# Altium schematic sheet Interface.SchDoc
size A2
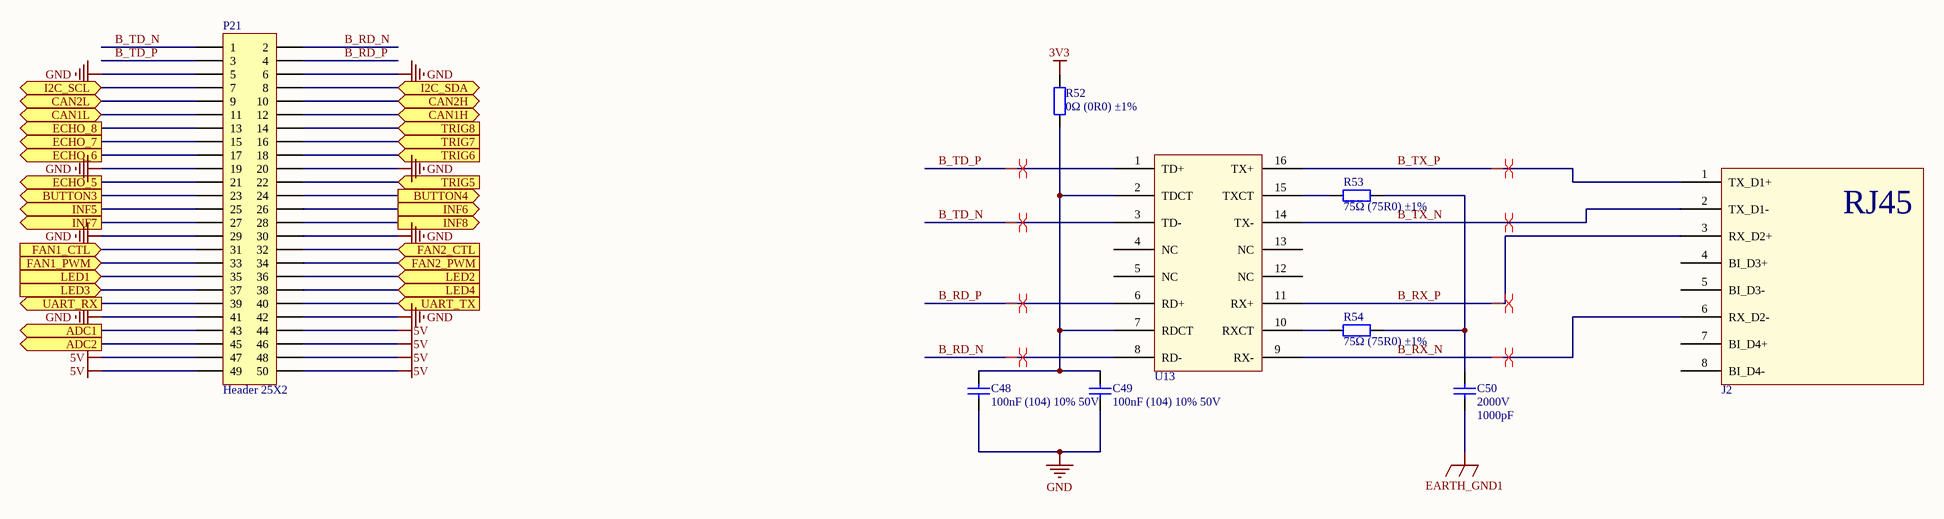
[diagram p0: Interface.SchDoc]

## Parts
C48  100nF (104) 10% 50V  [0603_C]
C49  100nF (104) 10% 50V  [0603_C]
C50  2000V  value 1000pF  [CAP1210N]
J2  Jack Modular Connector 8p8c (RJ45, Ethernet) Vertical Unshielded Cat3  [RJ45-5556416-1]  (value not drawn)
P21  Header 25X2  [HDR_2X25]
R52  0Ω (0R0) ±1%  [0603_R]
R53  75Ω (75R0) ±1%  [0603_R]
R54  75Ω (75R0) ±1%  [0603_R]
U13  TRANSFORMER  [Bel_transformer]  (value not drawn)

## Ports
ADC1 (out), ADC2 (out), BUTTON3 (out), BUTTON4 (out), CAN1H (bidir), CAN1L (bidir), CAN2H (bidir), CAN2L (bidir), ECHO_5 (out), ECHO_6 (out), ECHO_7 (out), ECHO_8 (out), FAN1_CTL (in), FAN1_PWM (in), FAN2_CTL (in), FAN2_PWM (in), I2C_SCL (bidir), I2C_SDA (bidir), INF5 (out), INF6 (out), INF7 (out), INF8 (out), LED1 (in), LED2 (in), LED3 (in), LED4 (in), TRIG5 (in), TRIG6 (in), TRIG7 (in), TRIG8 (in), UART_RX (out), UART_TX (in)

## Nets
3V3: R52.2
5V: P21.44 P21.46 P21.47 P21.48 P21.49 P21.50
EARTH_GND1: C50.1
GND: C48.2 C49.1 P21.5 P21.6 P21.19 P21.20 P21.29 P21.30 P21.41 P21.42
ADC1: P21.43 ; port ADC1
ADC2: P21.45 ; port ADC2
B_RD_N: P21.2 U13.8(RD-)
B_RD_P: P21.4 U13.6(RD+)
B_RX_N: J2.6(RX_D2-) U13.9(RX-)
B_RX_P: J2.3(RX_D2+) U13.11(RX+)
B_TD_N: P21.1 U13.3(TD-)
B_TD_P: P21.3 U13.1(TD+)
B_TX_N: J2.2(TX_D1-) U13.14(TX-)
B_TX_P: J2.1(TX_D1+) U13.16(TX+)
BUTTON3: P21.23 ; port BUTTON3
BUTTON4: P21.24 ; port BUTTON4
CAN1H: P21.12 ; port CAN1H
CAN1L: P21.11 ; port CAN1L
CAN2H: P21.10 ; port CAN2H
CAN2L: P21.9 ; port CAN2L
ECHO_5: P21.21 ; port ECHO_5
ECHO_6: P21.17 ; port ECHO_6
ECHO_7: P21.15 ; port ECHO_7
ECHO_8: P21.13 ; port ECHO_8
FAN1_CTL: P21.31 ; port FAN1_CTL
FAN1_PWM: P21.33 ; port FAN1_PWM
FAN2_CTL: P21.32 ; port FAN2_CTL
FAN2_PWM: P21.34 ; port FAN2_PWM
I2C_SCL: P21.7 ; port I2C_SCL
I2C_SDA: P21.8 ; port I2C_SDA
INF5: P21.25 ; port INF5
INF6: P21.26 ; port INF6
INF7: P21.27 ; port INF7
INF8: P21.28 ; port INF8
LED1: P21.35 ; port LED1
LED2: P21.36 ; port LED2
LED3: P21.37 ; port LED3
LED4: P21.38 ; port LED4
TRIG5: P21.22 ; port TRIG5
TRIG6: P21.18 ; port TRIG6
TRIG7: P21.16 ; port TRIG7
TRIG8: P21.14 ; port TRIG8
UART_RX: P21.39 ; port UART_RX
UART_TX: P21.40 ; port UART_TX
NetC48_1: C48.1 C49.2 R52.1 U13.2(TDCT) U13.7(RDCT)
NetC50_2: C50.2 R53.2 R54.2
NetR53_1: R53.1 U13.15(TXCT)
NetR54_1: R54.1 U13.10(RXCT)

Not connected (* = marked no-connect by the designer): J2 4(BI_D3+) 5(BI_D3-) 7(BI_D4+) 8(BI_D4-); U13 4(NC) 5(NC) 12(NC) 13(NC)

## Layout directives
differential pair: B_RD_N, B_RD_P, B_RX_N, B_RX_P, B_TD_N, B_TD_P, B_TX_N, B_TX_P

## Notes on the sheet
- (in symbol 5556416-1) RJ45

## Library data of the parts
C48 C49 = 0603 100nF (104) 10% 50V: 贴片电容; ComponentLink1Description: 供应商链接; ComponentLink1URL: http://www.szlcsc.com/product/details_15331.html; Package: 0603; Supplier: LC; SuppliersPartNumber: C14663
C50 = CAP 1000pF ±10% 2000V (2kV) Ceramic Capacitor X7R 1210 (3225 Metric): Manufacturer: Samsung Electro-Mechanics; Manufacturer Part Number: CL32B102KJFNNNE; Unit Price in Quantity: 0.0884; Part Number: CAP 1000pF ±10% 2000V (2kV) Ceramic Capacitor X7R 1210 (3225 Metric); Component Type: Standard; Mounting Type: smt; Supplier 1: Digikey; Supplier 1 Part Number: 1276-3316-6-ND; Part URL-Supplier 1: https://www.digikey.com/product-detail/en/samsung-electro-mechanics/CL32B102KJFNNNE/1276-3316-6-ND/3893831; Unit Price-Supplier 1: 0.34; Price Break: 1000; Vendor/Distributor: Digikey; Package: 1210
J2 = 5556416-1: RJ45 connector 180 degrees; Manufacturer: TE; Unit Price in Quantity: .5722; Part Number: 5556416-1; Mounting Type: thru-hole; Package: Header; Component Type: Standard; Pin Count: 8; Manufacturer Part Number: 5556416-1; Supplier 1: Digikey; Supplier 1 Part Number: A31428-ND; Unit Price-Supplier 1: 1.04; Price Break: 1000; Vendor/Distributor: Digikey
P21 = Header 25X2: Header, 25-Pin, Dual row; LatestRevisionDate: 17-Jul-2002; LatestRevisionNote: Re-released for DXP Platform.; Publisher: Altium Limited
R52 = 0603 0Ω (0R0) 1%: 贴片电阻; ComponentLink1Description: 供应商链接; ComponentLink1URL: http://www.szlcsc.com/product/details_21903.html; Package: 0603; Supplier: LC; SuppliersPartNumber: C21189
R53 R54 = 0603 75Ω (75R0) 1%: 贴片电阻; ComponentLink1Description: 供应商链接; ComponentLink1URL: http://www.szlcsc.com/product/details_4682.html; Package: 0603; Supplier: LC; SuppliersPartNumber: C4275
U13 = MODULE XFRMR LAN 10/100B-TX SMD: Manufacturer: Bel Fuse Inc.; Manufacturer Part Number: S558-5999-U7-F; Unit Price in Quantity: 1.9439; Part Number: MODULE XFRMR LAN 10/100B-TX SMD; Mounting Type: smt; Package: Non-standard; Component Type: Standard; DatasheetDocument: https://www.belfuse.com/resources/ICMs/lan-/S558-5999-U7-F.pdf; Supplier 1: Digikey; Supplier 1 Part Number: 507-1463-1-ND; Part URL-Supplier 1: https://www.digikey.sg/product-detail/zh/bel-fuse-inc/S558-5999-U7-F/507-1463-1-ND/2108047; Unit Price-Supplier 1: 3.6; Price Break: 900; Vendor/Distributor: Digikey